# Altium schematic sheet [03] - 28PIN_SCHEMATIC.SchDoc (part 1 of 3)
size A2; DocumentNumber: 3; SheetNumber: 3; SheetTotal: 5
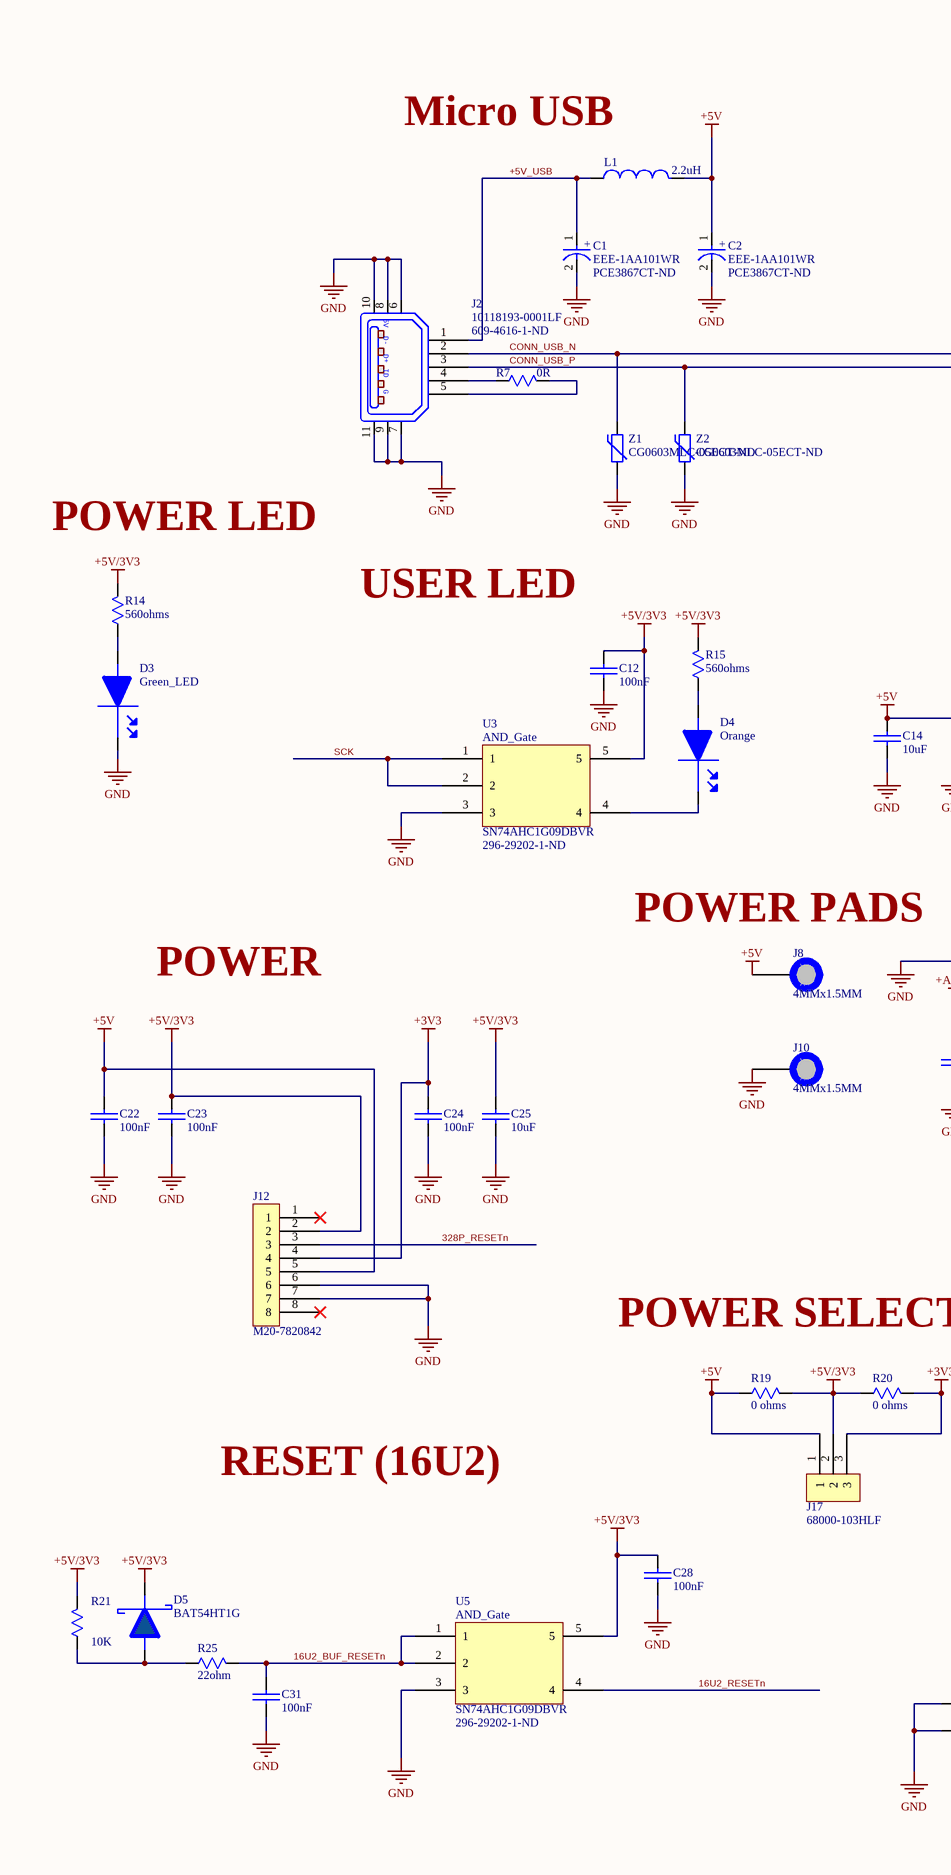
[diagram p0: [03] - 28PIN_SCHEMATIC.SchDoc, left]
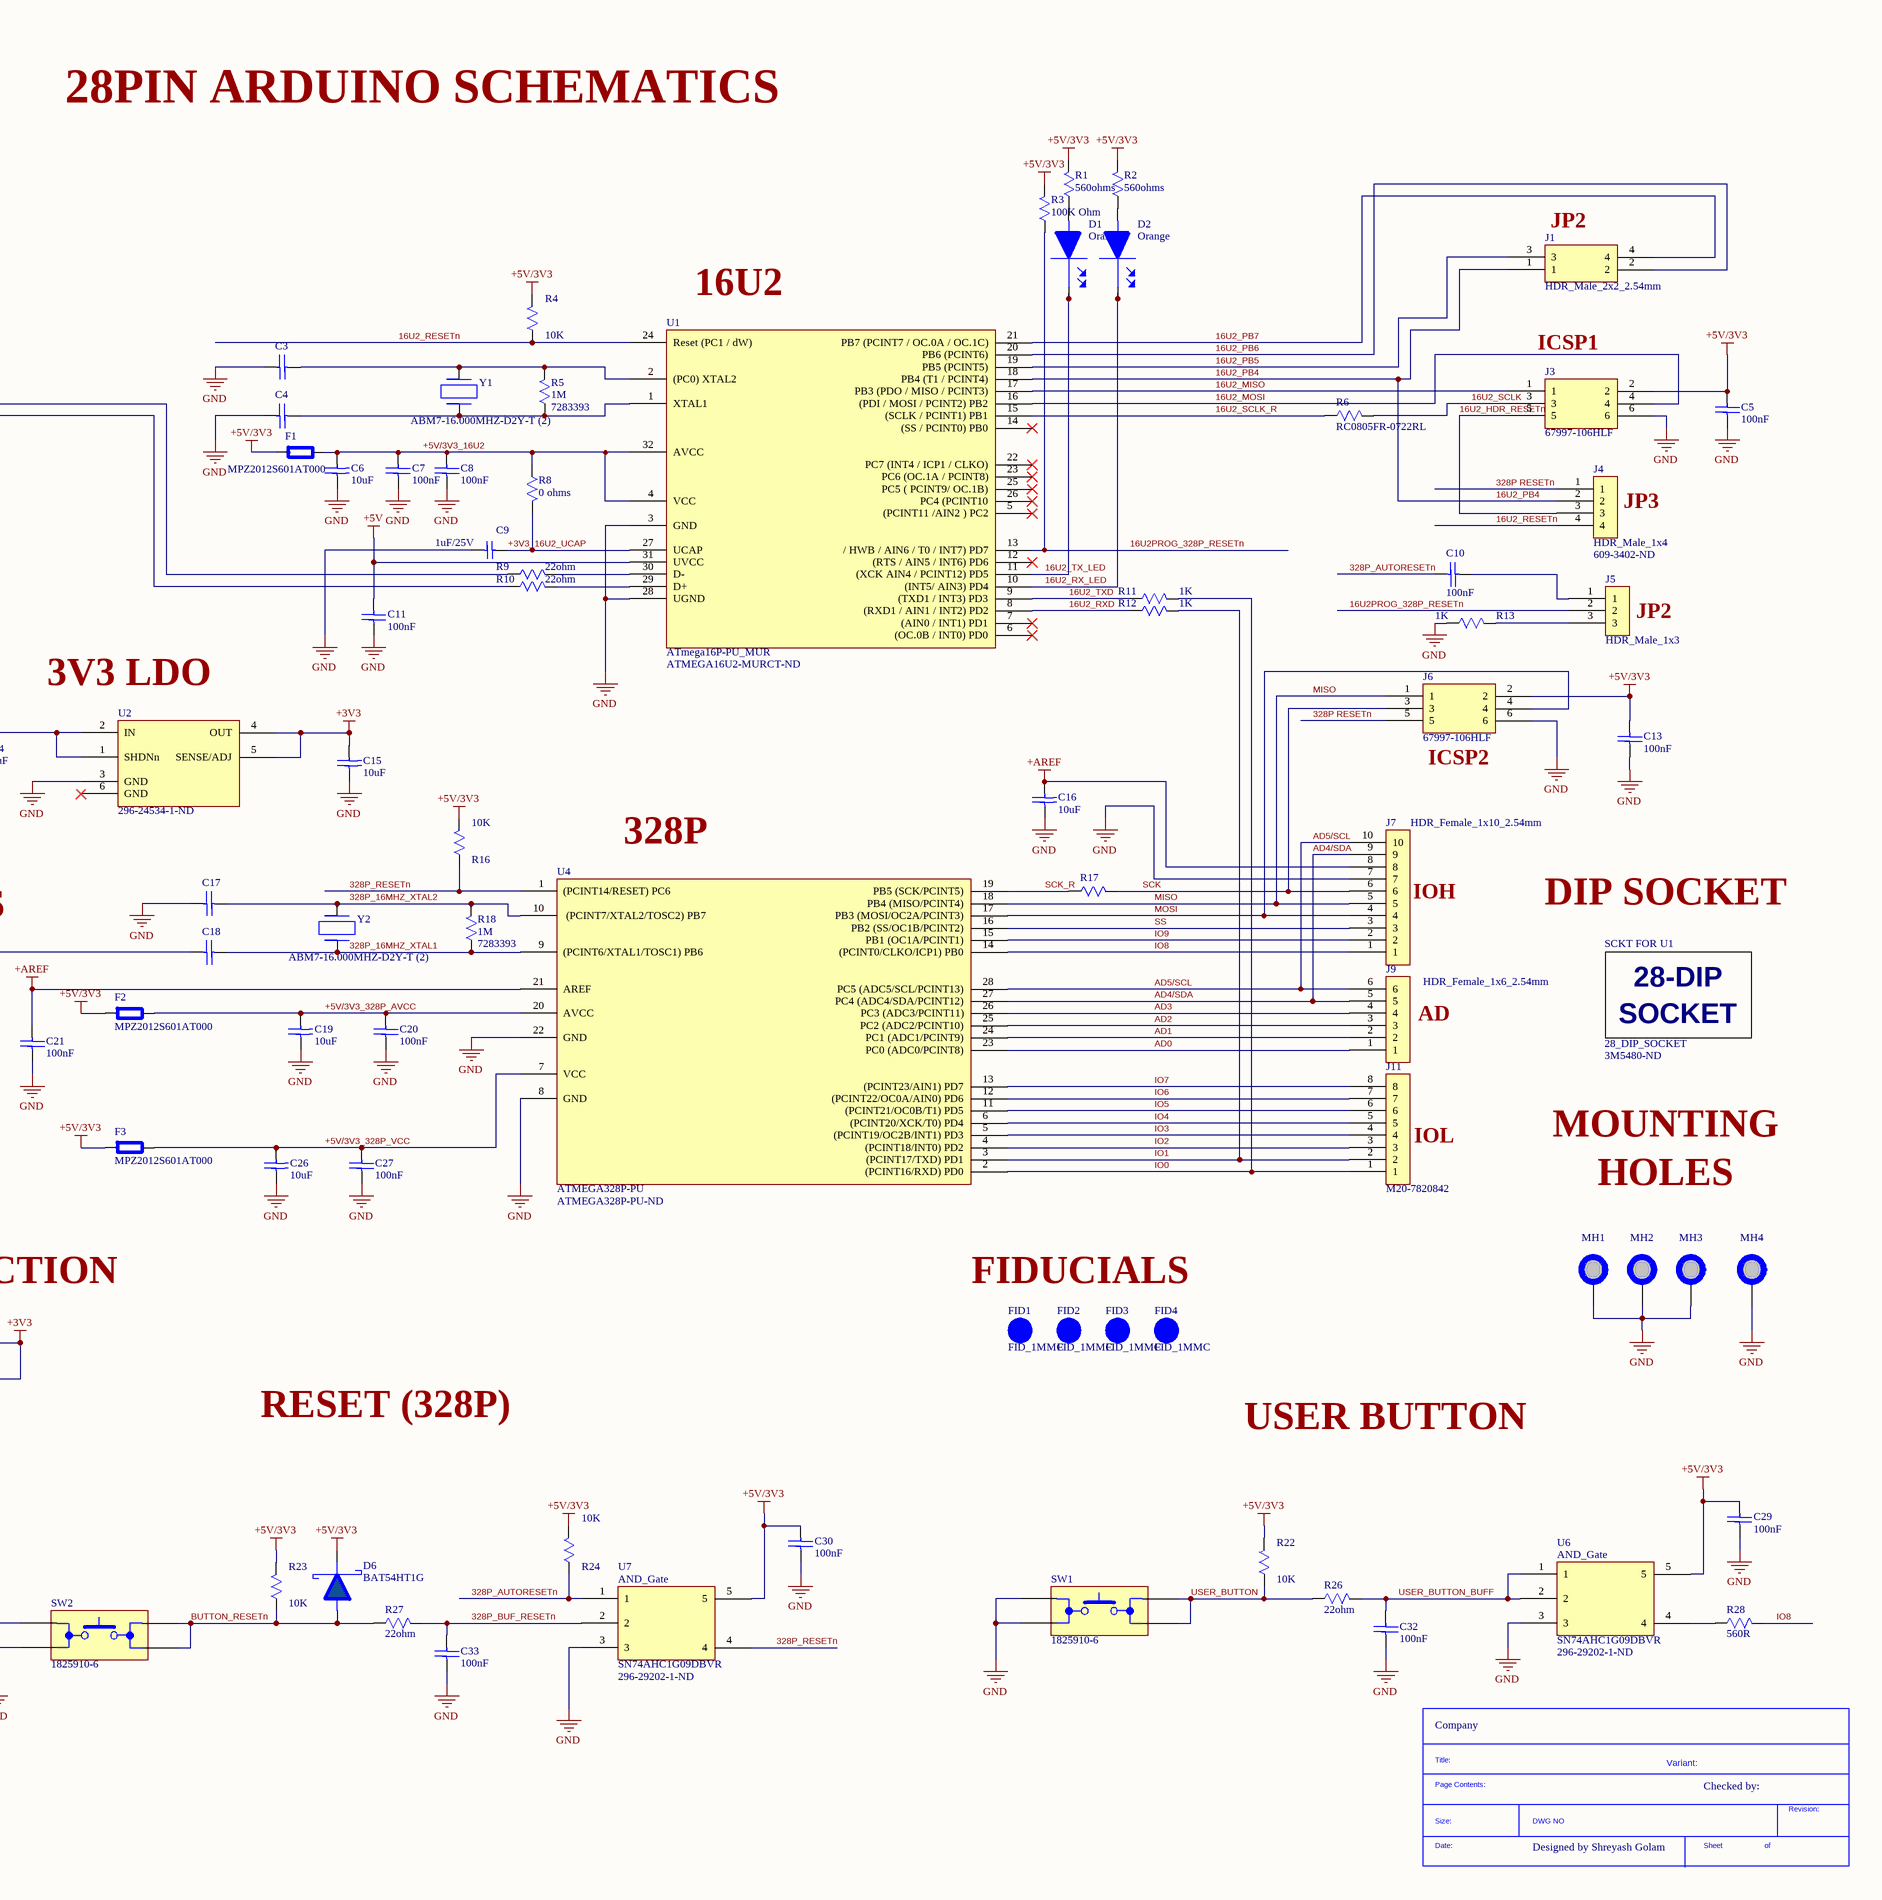
[diagram p1: [03] - 28PIN_SCHEMATIC.SchDoc, right]

## Parts
*?  SDTitleBlock  (value not drawn)  (graphical)
C1  EEE-1AA101WR  Supplier Part Number 1: PCE3867CT-ND  [C_ALU_C_Size]
C2  EEE-1AA101WR  Supplier Part Number 1: PCE3867CT-ND  [C_ALU_C_Size]
C3  C0805C180J5GACTU (2)  [C0805_100nf]  (value not drawn)
C4  C0805C180J5GACTU (2)  [C0805_100nf]  (value not drawn)
C5  100nF  [C_0805_10u]
C6  10uF  [C_0805_10u]
C7  100nF  [C_0805_10u]
C8  100nF  [C_0805_10u]
C9  1uF/25V  [C0805_100nf]
C10  100nF  [C_0805_10u]
C11  100nF  [C_0805_10u]
C12  100nF  [C_0805_10u]
C13  100nF  [C_0805_10u]
C14  10uF  [C_0805_10u]
C15  10uF  [C_0805_10u]
C16  10uF  [C_0805_10u]
C17  C0805C180J5GACTU (2)  [C0805_100nf]  (value not drawn)
C18  C0805C180J5GACTU (2)  [C0805_100nf]  (value not drawn)
C19  10uF  [C_0805_10u]
C20  100nF  [C_0805_10u]
C21  100nF  [C_0805_10u]
C22  100nF  [C_0805_10u]
C23  100nF  [C_0805_10u]
C24  100nF  [C_0805_10u]
C25  10uF  [C_0805_10u]
C26  10uF  [C_0805_10u]
C27  100nF  [C_0805_10u]
C28  100nF  [C_0805_10u]
C29  100nF  [C_0805_10u]
C30  100nF  [C_0805_10u]
C31  100nF  [C_0805_10u]
C32  100nF  [C_0805_10u]
C33  100nF  [C_0805_10u]
D1  Orange  [LED_0603]
D2  Orange  [LED_0603]
D3  Green_LED  [LED_0603]
D4  Orange  [LED_0603]
D5  BAT54HT1G  [Diode_323]
D6  BAT54HT1G  [Diode_323]
F1  MPZ2012S601AT000  [C0805_100nf]
F2  MPZ2012S601AT000  [C0805_100nf]
F3  MPZ2012S601AT000  [C0805_100nf]
FID1  FID_1MMC  [Fiducials]  (no BOM)
FID2  FID_1MMC  [Fiducials]  (no BOM)
FID3  FID_1MMC  [Fiducials]  (no BOM)
FID4  FID_1MMC  [Fiducials]  (no BOM)
J1  HDR_Male_2x2_2.54mm  [HDR_Male_2x2_2.54mm]
J2  10118193-0001LF  Supplier Part Number 1: 609-4616-1-ND  [USB_10118193]
J3  67997-106HLF  [HDR_Male_2x3_2.54mm]
J4  HDR_Male_1x4  Supplier Part Number 1: 609-3402-ND  [HDR_Female_1x4_2.54mm]
J5  HDR_Male_1x3  [HDR_Female_1x3_2.54mm]
J6  67997-106HLF  [HDR_Male_2x3_2.54mm]
J7  HDR_Female_1x10_2.54mm  [HDR_Female_1x10_2.54mm]
J8  4MMx1.5MM  [PAD_WITH_HOLE_4MMx1.5MM]  (no BOM)
J9  HDR_Female_1x6_2.54mm  [HDR_Female_1x6_2.54mm - duplicate - duplicate]
J10  4MMx1.5MM  [PAD_WITH_HOLE_4MMx1.5MM]  (no BOM)
J11  M20-7820842  [HDR_Female_1x8_2.54mm]
J12  M20-7820842  [HDR_Female_1x8_2.54mm]
J17  68000-103HLF  [HDR_Female_1x3_2.54mm]
L1  2.2uH  [C1210_IND]
MH1  MH_7.4mm_3.2mm  [MH_7.4mm_3.2mm]  (value not drawn)  (no BOM)
MH2  MH_7.4mm_3.2mm  [MH_7.4mm_3.2mm]  (value not drawn)  (no BOM)
MH3  MH_7.4mm_3.2mm  [MH_7.4mm_3.2mm]  (value not drawn)  (no BOM)
MH4  MH_NP_7.4mm_3.2mm  [MH_7.4mm_3.2mm_Non_plated]  (value not drawn)  (no BOM)
R1  560ohms  [R0805_1M]
R2  560ohms  [R0805_1M]
R3  100K Ohm  [R0805_1M]
R4  10K  [R0805_1M]
R5  1M  Supplier Part Number 1: 7283393  [R0805_1M]
R6  RC0805FR-0722RL  [R0805_1M]
R7  0R  [R0805_1M]
R8  0 ohms  [R0805_1M]
R9  22ohm  [R0805_1M]
R10  22ohm  [R0805_1M]
R11  1K  [R0805_1M]
R12  1K  [R0805_1M]
R13  1K  [R0805_1M]
R14  560ohms  [R0805_1M]
R15  560ohms  [R0805_1M]
R16  10K  [R0805_1M]
R17  RC0805FR-0722RL  [R0805_1M]  (value not drawn)
R18  1M  Supplier Part Number 1: 7283393  [R0805_1M]
R19  0 ohms  [R0805_1M]
R20  0 ohms  [R0805_1M]
R21  10K  [R0805_1M]
R22  10K  [R0805_1M]
R23  10K  [R0805_1M]
R24  10K  [R0805_1M]
R25  22ohm  [R0805_1M]
R26  22ohm  [R0805_1M]
R27  22ohm  [R0805_1M]
R28  560R  [R0805_1M]
SCKT_FOR_U1  28_DIP_SOCKET  Supplier Part Number 1: 3M5480-ND  [28_DIP_7.62mm_SOCKET]
SW1  1825910-6  [Switch_1825910-6]
SW2  1825910-6  [Switch_1825910-6]
U1  ATmega16P-PU_MUR  Supplier Part Number 1: ATMEGA16U2-MURCT-ND  [TQFP32]
U2  296-24534-1-ND  [LDO_regulator_DCQ]
U3  SN74AHC1G09DBVR  Supplier Part Number 1: 296-29202-1-ND  [AND_Gate_DBV_SOT_23_5]
U4  ATMEGA328P-PU  Supplier Part Number 1: ATMEGA328P-PU-ND  [ATMEGA328P-PU_28_DIP_7.62mm]
U5  SN74AHC1G09DBVR  Supplier Part Number 1: 296-29202-1-ND  [AND_Gate_DBV_SOT_23_5]
U6  SN74AHC1G09DBVR  Supplier Part Number 1: 296-29202-1-ND  [AND_Gate_DBV_SOT_23_5]
U7  SN74AHC1G09DBVR  Supplier Part Number 1: 296-29202-1-ND  [AND_Gate_DBV_SOT_23_5]
Y1  ABM7-16.000MHZ-D2Y-T (2)  [ABM_v1_1_BIG]
Y2  ABM7-16.000MHZ-D2Y-T (2)  [ABM_v1_1_BIG]
Z1  CG0603MLC-05ECT-ND  [R0603]
Z2  CG0603MLC-05ECT-ND  [R0603]

## Nets
+3V3: C15.2 C24.2 J12.4 J17.3 R20.2 U2.4(OUT) U2.5(SENSE/ADJ)
+5V: C2.1 C11.2 C14.2 C22.2 J8.1 J12.5 J17.1 L1.2 R19.1 U1.31(UVCC) U2.1(SHDNn) U2.2(IN)
+5V/3V3: C5.2 C12.2 C13.2 C23.2 C25.2 C28.2 C29.2 C30.2 D5.2(Cathode) D6.2(Cathode) F1.1 F2.1 F3.1 J3.2 J6.2 J12.2 J17.2 R1.2 R2.2 R3.2 R4.2 R14.2 R15.2 R16.2 R19.2 R20.1 R21.2 R22.2 R23.2 R24.2 U3.5 U5.5 U6.5 U7.5
+AREF: C16.2 C21.2 J7.8 U4.21(AREF)
GND: C1.2 C2.2 C3.2 C4.2 C5.1 C6.1 C7.1 C8.1 C9.1 C11.1 C12.1 C13.1 C14.1 C15.1 C16.1 C17.2 C18.2 C19.1 C20.1 C21.1 C22.1 C23.1 C24.1 C25.1 C26.1 C27.1 C28.1 C29.1 C30.1 C31.1 C32.1 C33.1 D3.1(Cathode) J2.6 J2.7 J2.8 J2.9 J2.10 J2.11 J3.6 J6.6 J7.7 J10.1 J12.6 J12.7 MH1.1 MH2.1 MH3.1 MH4.1 R13.1 SW1.1 SW1.2 SW2.1 SW2.2 U1.3(GND) U1.28(UGND) U2.3(GND) U3.3 U4.8(GND) U4.22(GND) U5.3 U6.3 U7.3 Z1.1 Z2.1
16U2_BUF_RESETn: C31.2 R25.2 U5.1 U5.2
16U2_HDR_RESETn: J3.5 J4.3
16U2_MISO: J3.1 U1.17(PB3_(PDO_/_MISO_/_PCINT3))
16U2_MOSI: J3.4 U1.16((PDI_/_MOSI_/_PCINT2)_PB2)
16U2_PB4: J1.1 J4.2 U1.18(PB4_(T1_/_PCINT4))
16U2_PB5: J1.3 U1.19(PB5_(PCINT5))
16U2_PB6: J1.2 U1.20(PB6_(PCINT6))
16U2_PB7: J1.4 U1.21(PB7_(PCINT7_/_OC.0A_/_OC.1C))
16U2_RESETn: J4.4 R4.1 U1.24(Reset_(PC1_/_dW)) U5.4
16U2_RX_LED: D2.1(Cathode) U1.10((INT5/_AIN3)_PD4)
16U2_RXD: R12.1 U1.8((RXD1_/_AIN1_/_INT2)_PD2)
16U2_SCLK: J3.3 R6.2
16U2_SCLK_R: R6.1 U1.15((SCLK_/_PCINT1)_PB1)
16U2_TX_LED: D1.1(Cathode) U1.11((XCK_AIN4_/_PCINT12)_PD5)
16U2_TXD: R11.1 U1.9((TXD1_/_INT3)_PD3)
16U2PROG_328P_RESETn: J5.2 R3.1 U1.13(/_HWB_/_AIN6_/_T0_/_INT7)_PD7)
328P RESETn: J4.1 J6.5
328P_16MHZ_XTAL1: C18.1 R18.1 U4.9((PCINT6/XTAL1/TOSC1)_PB6) Y2.1
328P_16MHZ_XTAL2: C17.1 R18.2 U4.10((PCINT7/XTAL2/TOSC2)_PB7) Y2.2
328P_AUTORESETn: C10.1 R24.1 U7.1
328P_BUF_RESETn: C33.2 R27.2 U7.2
328P_RESETn: J12.3 R16.1 U4.1((PCINT14/RESET)_PC6) U7.4
+3V3_16U2_UCAP: C9.2 R8.2 U1.27(UCAP)
+5V/3V3_16U2: C6.2 C7.2 C8.2 F1.2 R8.1 U1.4(VCC) U1.32(AVCC)
+5V/3V3_328P_AVCC: C19.2 C20.2 F2.2 U4.20(AVCC)
+5V/3V3_328P_VCC: C26.2 C27.2 F3.2 U4.7(VCC)
+5V_USB: C1.1 J2.1 L1.1
AD0: J9.1 U4.23(PC0_(ADC0/PCINT8))
AD1: J9.2 U4.24(PC1_(ADC1/PCINT9))
AD2: J9.3 U4.25(PC2_(ADC2/PCINT10))
AD3: J9.4 U4.26(PC3_(ADC3/PCINT11))
AD4/SDA: J7.9 J9.5 U4.27(PC4_(ADC4/SDA/PCINT12))
AD5/SCL: J7.10 J9.6 U4.28(PC5_(ADC5/SCL/PCINT13))
BUTTON_RESETn: D6.1(Anode) R23.1 R27.1 SW2.3 SW2.4
CONN_USB_N: J2.2 R9.1 Z1.2
CONN_USB_P: J2.3 R10.1 Z2.2
IO0: J11.1 R11.2 U4.2((PCINT16/RXD)_PD0)
IO1: J11.2 R12.2 U4.3((PCINT17/TXD)_PD1)
IO2: J11.3 U4.4((PCINT18/INT0)_PD2)
IO3: J11.4 U4.5((PCINT19/OC2B/INT1)_PD3)
IO4: J11.5 U4.6((PCINT20/XCK/T0)_PD4)
IO5: J11.6 U4.11((PCINT21/OC0B/T1)_PD5)
IO6: J11.7 U4.12((PCINT22/OC0A/AIN0)_PD6)
IO7: J11.8 U4.13((PCINT23/AIN1)_PD7)
IO8: J7.1 R28.2 U4.14((PCINT0/CLKO/ICP1)_PB0)
IO9: J7.2 U4.15(PB1_(OC1A/PCINT1))
MISO: J6.1 J7.5 U4.18(PB4_(MISO/PCINT4))
MOSI: J6.4 J7.4 U4.17(PB3_(MOSI/OC2A/PCINT3))
SCK: J6.3 J7.6 R17.2 U3.1 U3.2
SCK_R: R17.1 U4.19(PB5_(SCK/PCINT5))
SS: J7.3 U4.16(PB2_(SS/OC1B/PCINT2))
USER_BUTTON: R22.1 R26.1 SW1.3 SW1.4
USER_BUTTON_BUFF: C32.2 R26.2 U6.1 U6.2
NetC3_1: C3.1 R5.2 U1.2((PC0)_XTAL2) Y1.2
NetC4_1: C4.1 R5.1 U1.1(XTAL1) Y1.1
NetC10_2: C10.2 J5.1
NetD1_2: D1.2(Anode) R1.1
NetD2_2: D2.2(Anode) R2.1
NetD3_2: D3.2(Anode) R14.1
NetD4_1: D4.1(Cathode) U3.4
NetD4_2: D4.2(Anode) R15.1
NetD5_1: D5.1(Anode) R21.1 R25.1
NetJ2_4: J2.4 R7.1
NetJ2_5: J2.5 R7.2
NetJ5_3: J5.3 R13.2
NetR9_2: R9.2 U1.30(D-)
NetR10_2: R10.2 U1.29(D+)
NetR28_1: R28.1 U6.4

Not connected (* = marked no-connect by the designer): J12 1* 8*; U1 5((PCINT11_/AIN2_)_PC2)* 6((OC.0B_/_INT0)_PD0)* 7((AIN0_/_INT1)_PD1)* 12((RTS_/_AIN5_/_INT6)_PD6)* 14((SS_/_PCINT0)_PB0)* 22(PC7_(INT4_/_ICP1_/_CLKO))* 23(PC6_(OC.1A_/_PCINT8))* 25(PC5_(_PCINT9/_OC.1B))* 26(PC4_(PCINT10)*; U2 6(GND)*

## Notes on the sheet
- 28PIN ARDUINO SCHEMATICS
- (near L1) Micro USB
- (near J1) JP2
- (near U1) 16U2
- (near J3) ICSP1
- (near J4) JP3
- POWER LED
- USER LED
- (near J5) JP2
- (near U2) 3V3 LDO
- (near J6) ICSP2
- (near U4) 328P
- (near J7) IOH
- DIP SOCKET
- POWER
- (near J8) POWER PADS
- (near J9) AD
- (near J11) IOL
- MOUNTING
- HOLES
- POWER SELECTION
- FIDUCIALS
- RESET (16U2)
- RESET (328P)
- USER BUTTON
- (near *?) Company
- Variant:
- Checked by:
- Designed by Shreyash Golam
- (in symbol 28_DIP_SOCKET) 28-DIP; SOCKET
- (in symbol 100uF) +
- (in symbol SDTitleBlock) Title:; Page Contents:; Revision:; Size:; DWG NO; Date:; Sheet; of
- (in symbol USB_Header) 5V; D-; D+; ID; G